# EAGLE design syringe board 2.1 (EAGLE 9.0.0)
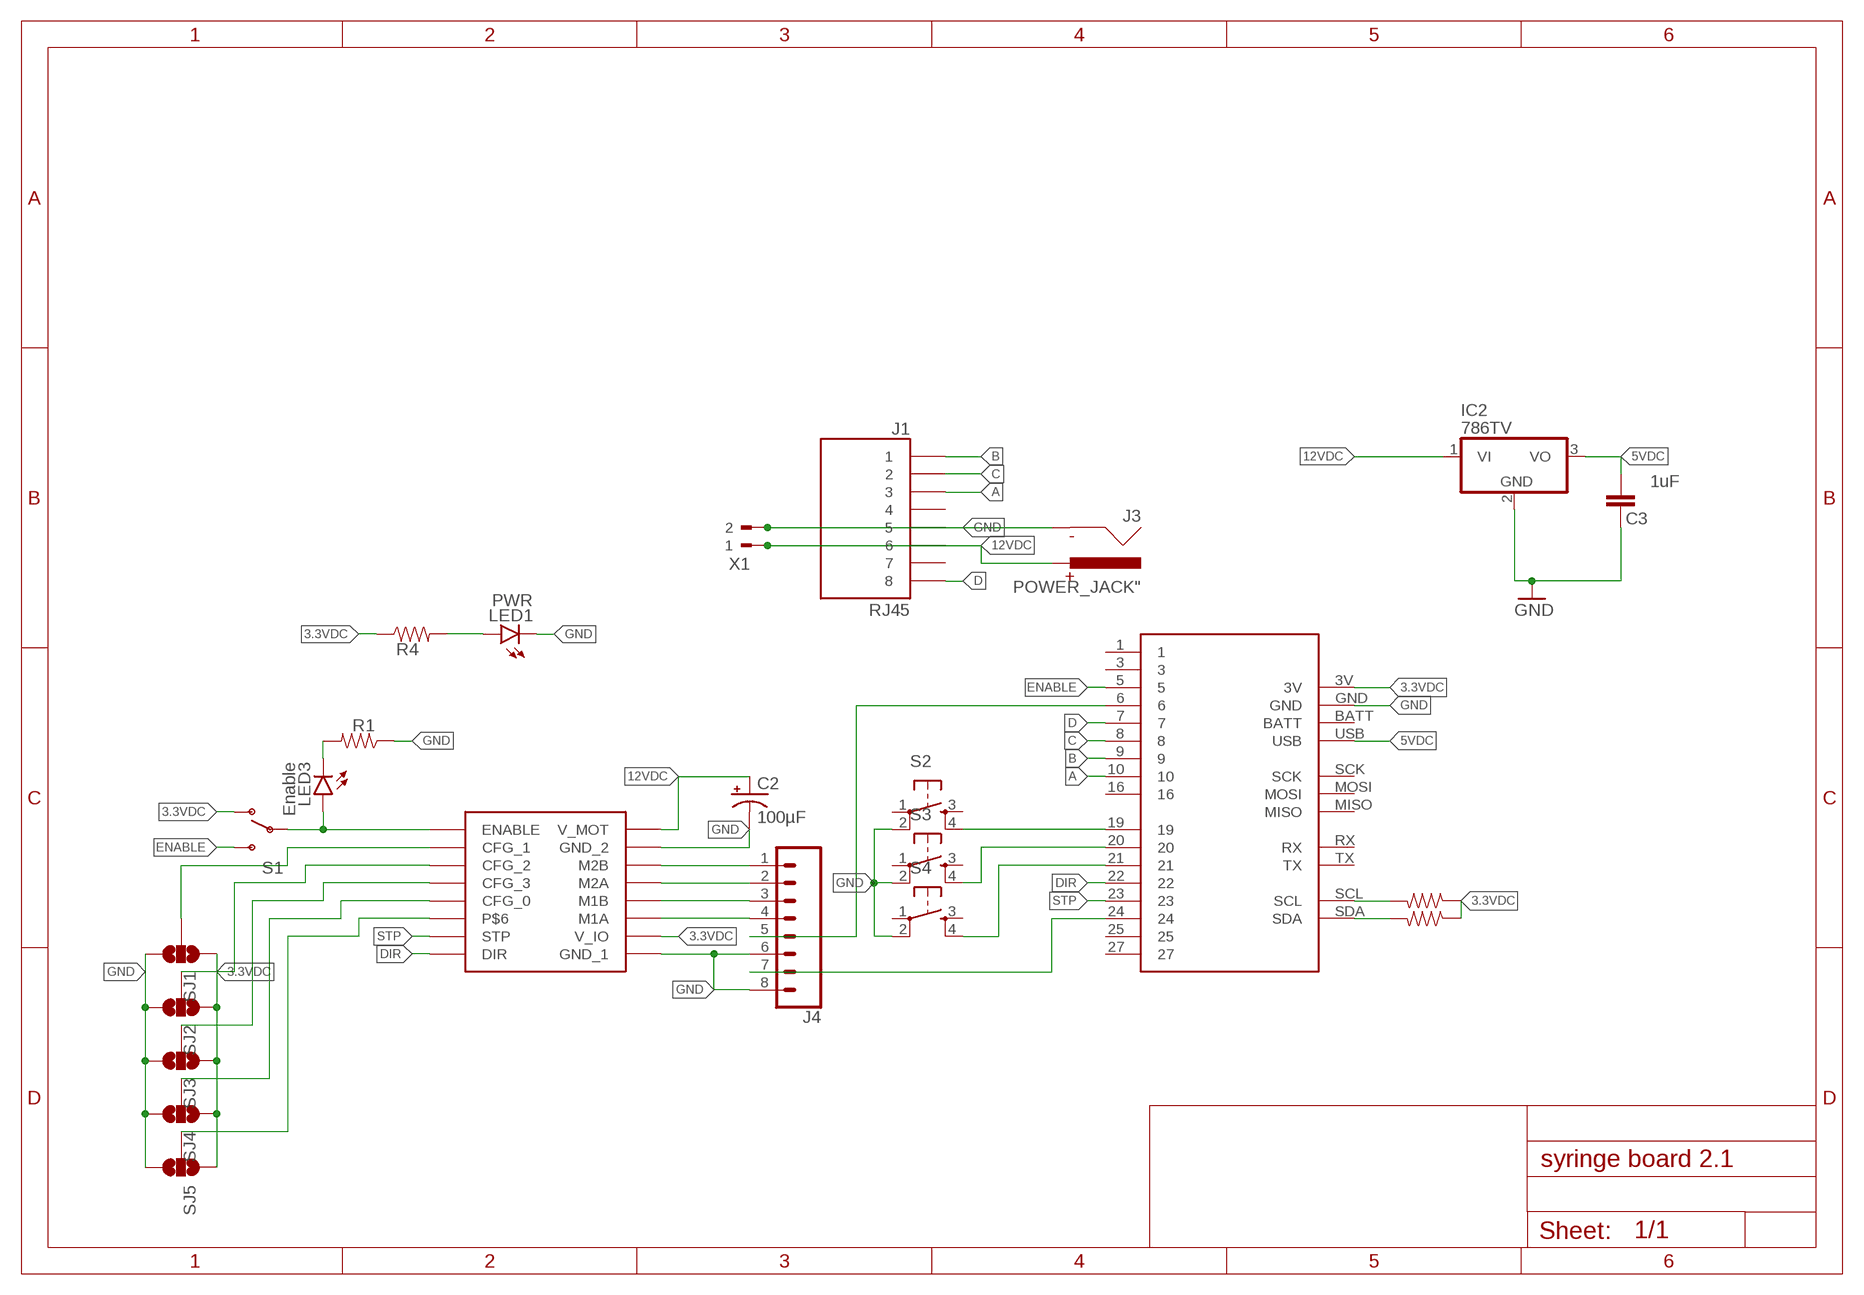
[diagram p0: schematic, sheet 1]

## Parts
C2  100µF  CPOL-USD  [PANASONIC_D]
C3  1uF  CAP0603-CAP  [0603-CAP]
IC2  786TV  [TO220V]
J1  RJ45  [RJ45-8]
J3  POWER_JACK"  [BARREL_CONN]
J4  CONN_08NO_SILK_FEMALE_PTH  [1X08_NO_SILK]
LED1  PWR  LED0603  [LED-0603]
LED3  Enable  LED0603  [LED-0603]
R1  RESISTOR0603  [0603]
R4  RESISTOR0603  [0603]
R17  RESISTOR0603  [0603]
R20  RESISTOR0603  [0603]
S1  SWITCH-SPDTVERTICAL_TOGGLE  [VERT_TOGGLE]
S2  TAC_SWITCHSMD  TAC_SWITCHPTH  [TACTILE-PTH]
S3  TAC_SWITCHSMD  TAC_SWITCHPTH  [TACTILE-PTH]
S4  TAC_SWITCHSMD  TAC_SWITCHPTH  [TACTILE-PTH]
SJ1  SOLDERJUMPER_2WAYS  [SJ_3]
SJ2  SOLDERJUMPER_2WAYS  [SJ_3]
SJ3  SOLDERJUMPER_2WAYS  [SJ_3]
SJ4  SOLDERJUMPER_2WAYS  [SJ_3]
SJ5  SOLDERJUMPER_2WAYS  [SJ_3]
U$1  SILENT_STEP_STICK  [SILENT_STEP_STICK]
U$2  FEATHERFEAT  [FEATHER]
X1  90-2  [90-2]

## Nets
3.3VDC: R4.1 R17.1 R20.1 S1.P$1(O) SJ1.1 SJ2.1 SJ3.1 SJ4.1 SJ5.1 U$1.V_IO U$2.3V
5VDC: C3.2 IC2.3(VO) U$2.USB
12VDC: C2.+ IC2.1(VI) J1.6 J3.PWR U$1.V_MOT X1.1
A: J1.3 U$2.10
B: J1.1 U$2.9
C: J1.2 U$2.8
CFG_0: SJ4.2 U$1.CFG_0
CFG_1: SJ1.2 U$1.CFG_1
CFG_2: SJ2.2 U$1.CFG_2
CFG_3: SJ3.2 U$1.CFG_3
D: J1.8 U$2.7
DIR: U$1.DIR U$2.22
ENABLE: S1.P$3(S) U$2.5
GND: C2.- C3.1 IC2.2(GND) J1.5 J3.GND J4.6 J4.8 LED1.C R1.1 S2.2 S3.2 S4.2 SJ1.3 SJ2.3 SJ3.3 SJ4.3 SJ5.3 U$1.G_1(GND_1) U$1.G_2(GND_2) U$2.GND X1.2
N$1: R17.2 U$2.SCL
N$2: J4.5 U$2.6
N$3: R20.2 U$2.SDA
N$4: J4.1 U$1.M2B
N$6: LED3.A S1.P$2(P) U$1.ENABLE
N$7: S2.4 U$2.19
N$8: LED1.A R4.2
N$9: J4.2 U$1.M2A
N$10: LED3.C R1.2
N$11: S3.4 U$2.20
N$12: S4.4 U$2.21
N$14: J4.3 U$1.M1B
N$15: J4.4 U$1.M1A
N$16: J4.7 U$2.24
N/C: SJ5.2 U$1.P$6
STP: U$1.STP U$2.23
Unconnected: J1.4 J1.7 S2.1 S2.3 S3.1 S3.3 S4.1 S4.3 U$2.1 U$2.3 U$2.16 U$2.25 U$2.27 U$2.BATT U$2.MISO U$2.MOSI U$2.RX U$2.SCK U$2.TX

## Library data of the parts
C2 = adafruit:CPOL-US: POLARIZED CAPACITOR, American symbol
C3 = SparkFun-Capacitors:CAP: Capacitor Standard 0603 ceramic capacitor, and 0.1" leaded capacitor.
IC2 = Andy-library:78*: Positive VOLTAGE REGULATOR Source: http://cache.national.com/ds/LM/LM78L05.pdf http://www.fairchildsemi.com/ds/LM/LM7805.pdf
J1 = Andy-library:RJ45
J3 = Andy-library:POWER_JACK: 5mm Barrel Power Connector CP-037A-ND <http://www.digikey.com/product-detail/en/cui-inc/PJ-037A/CP-037A-ND/1644545>; DIGIKEY_PN: CP-037A-ND; MANUFACTURER: CUI Inc; MFG_PN: PJ-037A
J4 = SparkFun-Connectors:CONN_08: Multi connection point. Often used as Generic Header-pin footprint for 0.1 inch spaced/style header connections On any of the 0.1 inch spaced packages, you can populate with these: Break Away Headers - Straight <https://www.sparkfun.com/products/116> (PRT-00116) Break Away Male Headers - Right Angle <https://www.sparkfun.com/products/553> (PRT-00553) Female Headers <https://www.sparkfun.com/products/115> (PRT-00115) Break Away Headers - Machine Pin <https://www.sparkfun.com/products/117> (PRT-00117) Break Away Female Headers - Swiss Machine Pin <https://www.sparkfun.com/products/743> (PRT-00743) Arduino Stackable Header - 8 Pin <https://www.sparkfun.com/products/9279> (PRT-09279) For SCREWTERMINALS and SPRING TERMINALS visit here: Screw Terimnals on SparkFun.com <https://www.sparkfun.com/search/results?term=Screw+Terminals> (5mm/3.5mm/2.54mm spacing) This device is also useful as a general connection point to wire up your design to another part of your project. Our various solder wires solder well into these plated through hole pads. Hook-Up Wire - Assortment (Stranded, 22 AWG) <https://www.sparkfun.com/products/11375> (PRT-11375) Hook-Up Wire - Assortment (Solid Core, 22 AWG) <https://www.sparkfun.com/products/11367> (PRT-11367) View the entire wire category on our website here <https://www.sparkfun.com/categories/141> Special notes: Molex polarized connector foot print use with SKU : PRT-08231 with associated crimp pins and housings. 1MM SMD Version SKU: PRT-10208 NOTES ON THE VARIANTS LOCK and LOCK_LONGPADS... This footprint was designed to help hold the alignment of a through-hole component (i.e. 6-pin header) while soldering it into place. You may notice that each hole has been shifted either up or down by 0.005 of an inch from it's more standard position (which is a perfectly straight line). This slight alteration caused the pins (the squares in the middle) to touch the edges of the holes. Because they are alternating, it causes a "brace" to hold the component in place. 0.005 has proven to be the perfect amount of "off-center" position when using our standard breakaway headers. Although looks a little odd when you look at the bare footprint, once you have a header in there, the alteration is very hard to notice. Also,if you push a header all the way into place, it is covered up entirely on the bottom side.; PROD_ID: CONN-08438
LED1 LED3 = Andy-library:LED: LEDs Standard schematic elements and footprints for 5mm, 3mm, 1206, and 0603 sized LEDs. 5mm - Spark Fun Electronics SKU : COM-00529 (and others)
R1 R4 R17 R20 = SparkFun-Resistors:RESISTOR: Generic Resistor Package
S1 = Andy-library:SWITCH-SPDT: SPDT Switch slide switch: AYZ0102AGRLC <http://www.digikey.com/product-detail/en/c-k/AYZ0102AGRLC/401-2012-1-ND/1640121> vertical toggle: ATE1D-2M3-10-Z <http://www.digikey.com/product-search/en?keywords=ATE1D-2M3-10-Z> horizontal toggle: ATE1D-5M3-10-Z <http://www.digikey.com/product-search/en?keywords=ATE1D-5M3-10-Z>
S2-S4 = Andy-library:TAC_SWITCH: Momentary Switch Button commonly used for reset or general input. Spark Fun Electronics SKU : COM-00097 SMT- SWCH-08247
SJ1-SJ5 = SparkFun-Retired:SOLDERJUMPER_2WAY: Solder Jumper 2 way solder jumper
U$1 = Andy-library:SILENT_STEP_STICK
U$2 = Andy-library:FEATHER
X1 = con-weidmueller-sl35:90-2: WEIDMUELLER CLAMP CONNECTOR; OC_FARNELL: unknown; OC_NEWARK: unknown

## Board
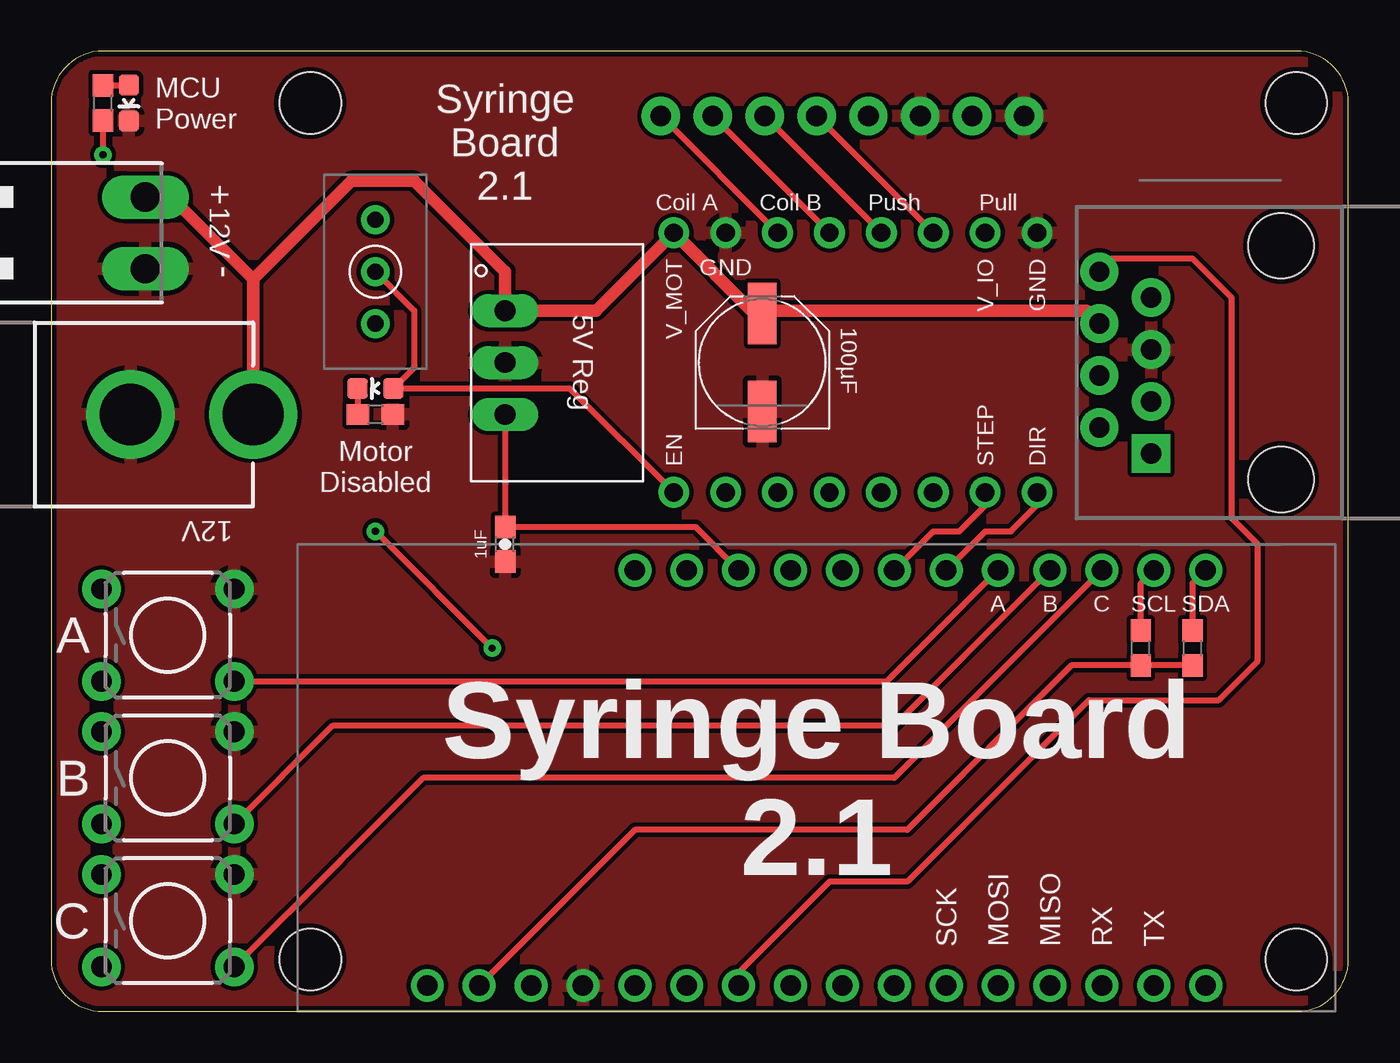
[diagram p1: board, top side]
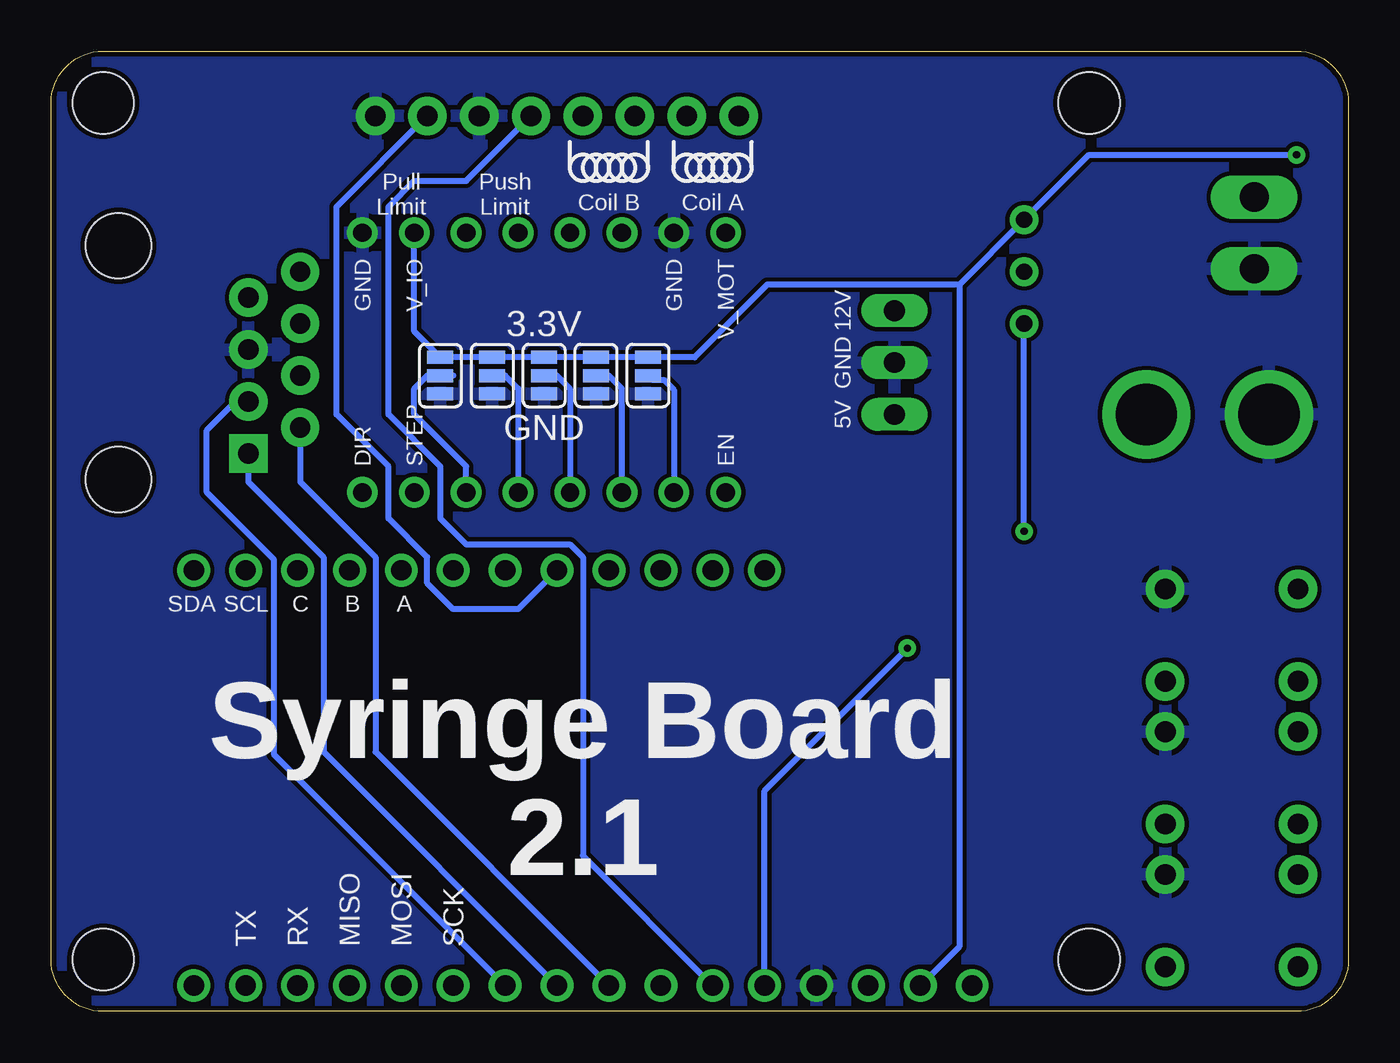
[diagram p2: board, bottom side, seen from below]

Size 63.5 x 46.99 mm. Coordinates in mm from the lower left corner, seen from the top.
Outline: 0,44.45 0,2.54 arc90 2.54,0 60.96,0 arc90 63.5,2.54 63.5,44.45 arc90 60.96,46.99 2.54,46.99 arc90 0,44.45
Copper layers (1*16): Top 0.035mm / dielectric 1.5mm / Bottom 0.035mm
Design rules "GoldPhoenix_8and8 *": minimum track width 7mil, minimum drill 15mil, track to track 8mil, track to pad 8mil, pad to pad 8mil, via to via 8mil, smd to smd 8mil, copper to edge 10mil, drill to drill 8mil, minimum pad ring 12mil, minimum via ring 10mil, stop-mask expansion 4mil, vias tented up to drill 25mil, thermal gap 10mil
Holes 3 mm at 12.68,2.54 60.94,44.45 60.94,2.54 12.68,44.45

### Footprints (pad centres in the part's own frame; a part is rotated, then mirrored left to right if it is on the bottom)
PANASONIC_D = smd 3 x 1.4: + 2.4,0; - -2.4,0
0603-CAP = smd 1.1 x 1: 1 -0.85,0; 2 0.85,0
TO220V = drill 1.016 long: 1 -2.54,-2.54; 2 0,-2.54; 3 2.54,-2.54
RJ45-8 = drill 1 pad 1.88 square: 1 -4.445,6.35 | drill 1 pad 1.88: 2 -3.175,8.89; 3 -1.905,6.35; 4 -0.635,8.89; 5 0.635,6.35; 6 1.905,8.89; 7 3.175,6.35; 8 4.445,8.89 | hole 3.2: -5.715,0; 5.715,0
BARREL_CONN = drill 2.997 pad 4.318: GND 0,7.7; PWR 0,13.7
1X08_NO_SILK = drill 1.016 pad 1.88: 1 0,0; 2 2.54,0; 3 5.08,0; 4 7.62,0; 5 10.16,0; 6 12.7,0; 7 15.24,0; 8 17.78,0
LED-0603 = smd 1 x 1: A 0,-0.877; C 0,0.877
0603 = smd 1.1 x 1: 1 -0.85,0; 2 0.85,0
VERT_TOGGLE = drill 0.8: P$1 0,2.54; P$2 0,0; P$3 0,-2.54
TACTILE-PTH = drill 1.016 pad 1.88: 1 -3.251,2.261; 2 3.251,2.261; 3 -3.251,-2.261; 4 3.251,-2.261
SJ_3 = smd 0.635 x 1.27: 1 -0.889,0; 2 0,0; 3 0.889,0
SILENT_STEP_STICK = drill 0.9: CFG_0 -6.35,-1.27; CFG_1 -6.35,6.35; CFG_2 -6.35,3.81; CFG_3 -6.35,1.27; DIR -6.35,-8.89; ENABLE -6.35,8.89; G_1 6.35,-8.89; G_2 6.35,6.35; M1A 6.35,-3.81; M1B 6.35,-1.27; M2A 6.35,1.27; M2B 6.35,3.81; P$6 -6.35,-3.81; STP -6.35,-6.35; V_IO 6.35,-6.35; V_MOT 6.35,8.89
FEATHER = drill 1: 1 -19.05,-10.16; 3 -13.97,-10.16; 3V -16.51,-10.16; 5 -8.89,-10.16; 6 -6.35,-10.16; 7 -3.81,-10.16; 8 -1.27,-10.16; 9 1.27,-10.16; 10 3.81,-10.16; 16 19.05,-10.16; 19 13.97,10.16; 20 11.43,10.16; 21 8.89,10.16; 22 6.35,10.16; 23 3.81,10.16; 24 1.27,10.16; 25 -1.27,10.16; 27 -6.35,10.16; BATT -8.89,10.16; GND -11.43,-10.16; MISO 11.43,-10.16; MOSI 8.89,-10.16; RX 13.97,-10.16; SCK 6.35,-10.16; SCL 16.51,10.16; SDA 19.05,10.16; TX 16.51,-10.16; USB -3.81,10.16
90-2 = drill 1.422 long: 1 -1.75,5.25; 2 1.75,5.25

### Placement (x,y rotation side)
C2  34.81,31.75 90 top
C3  22.23,22.86 90 top
IC2  24.77,31.75 270 top
J1  60.2,31.75 90 top
J3  -3.81,29.21 270 top
J4  29.84,43.81 0 top
LED1  3.81,44.45 180 top
LED3  15.88,30.48 90 top
R1  15.88,29.21 180 top
R4  2.54,44.45 90 top
R17  53.34,17.78 90 top
R20  55.88,17.78 90 top
S1  15.88,36.2 0 top
S2  5.71,4.45 0 top
S3  5.71,11.43 0 top
S4  5.71,18.41 0 top
SJ1  34.29,31.11 270 bottom
SJ2  36.83,31.11 270 bottom
SJ3  39.37,31.11 270 bottom
SJ4  41.91,31.11 270 bottom
SJ5  44.45,31.11 270 bottom
U$1  39.37,31.75 90 top
U$2  37.47,11.43 0 top
X1  -0.64,38.1 270 top

### Tracks (layer width: path | path; a pad name or v marks a point on that pad's centre or on a via)
3.3VDC  (via drill 0.35)
  Top 0.305: R20.1 R17.1 49.95,16.93 41.91,8.89 28.57,8.89 U$2.3V | 2.54,43.18 R4.1 v2.54,41.91
  Bottom 0.305: U$1.V_IO 45.72,33.27 SJ5.1 SJ4.1 SJ3.1 SJ2.1 SJ1.1 32,32 28.45,35.56 19.05,35.56 | 19.05,35.56 S1.P$1 12.7,41.91 v2.54,41.91 | U$2.3V 19.05,3.17 19.05,35.56
5VDC
  Top 0.305: 22.23,28.59 IC2.3 C3.2 31.54,23.71 U$2.USB
12VDC
  Top 0.61: J3.PWR 9.89,35.83 | X1.1 5.87,39.85 9.89,35.83 | 9.89,35.83 14.7,40.64 17.78,40.64 22.23,36.2 IC2.1 26.67,34.29 U$1.V_MOT 34.43,34.15 C2.+ 34.95,34.29 50.67,34.29 J1.6
A
  Bottom 0.305: U$2.10 52.59,12.59 52.59,22.11 55.88,25.4 55.88,28.43 53.85,30.46 J1.3
B
  Bottom 0.305: J1.1 53.85,25.91 50.16,22.23 50.16,12.7 U$2.9
C
  Bottom 0.305: J1.2 51.31,25.91 47.62,22.23 47.62,12.7 U$2.8
CFG_0
  Bottom 0.305: SJ4.2 41.27,31.11 40.64,30.48 U$1.CFG_0
CFG_1
  Bottom 0.305: SJ1.2 34.07,30.9 33.51,30.9 33.02,30.41 U$1.CFG_1
CFG_2
  Bottom 0.305: U$1.CFG_2 35.56,30.48 36.2,31.11 SJ2.2
CFG_3
  Bottom 0.305: SJ3.2 38.73,31.11 38.1,30.48 U$1.CFG_3
D
  Top 0.305: U$2.7 33.66,1.91 38.1,6.35 41.91,6.35 50.8,15.24 57.15,15.24 59.05,17.14 59.05,22.86 57.78,24.13 57.78,34.92 55.88,36.83 51.94,36.83 J1.8
DIR
  Top 0.305: U$2.22 45.4,23.18 45.72,23.5 46.99,23.5 48.26,24.77 U$1.DIR
ENABLE  (via drill 0.35)
  Top 0.305: v21.59,17.78 v15.88,23.5
  Bottom 0.305: U$2.5 28.57,10.79 v21.59,17.78 | v15.88,23.5 S1.P$3
GND
  pour Bottom: -1.29,49.78 69.96,49.66 69.83,-3.81 -1.29,-3.81
  pour Top: -2.57,48.45 67.41,48.32 67.29,-5.08 -2.56,-5.08
N$1
  Top 0.305: R17.2 53.34,20.95 U$2.SCL
N$2
  Bottom 0.305: J4.5 43.18,40.64 45.72,40.64 46.99,39.37 46.99,29.21 44.45,26.67 44.45,24.13 43.18,22.86 38.1,22.86 37.47,22.23 37.47,7.62 U$2.6
N$3
  Top 0.305: U$2.SDA 55.88,20.95 R20.2
N$4
  Top 0.305: U$1.M2B J4.1
N$6
  Top 0.305: S1.P$2 17.78,34.29 17.78,31.51 LED3.A 17.78,30.48 18.41,30.48 25.4,30.48 U$1.ENABLE
N$7
  Top 0.305: S2.4 14.19,7.4 14.4,7.62 18.21,11.43 41.27,11.43 U$2.19
N$8
  Top 0.305: R4.2 2.57,45.33 LED1.A
N$9
  Top 0.305: U$1.M2A J4.2
N$10
  Top 0.305: R1.2 15.03,30.45 LED3.C
N$11
  Top 0.305: U$2.20 41.27,13.97 13.77,13.97 S3.4
N$12
  Top 0.305: S4.4 40.92,16.15 U$2.21
N$14
  Top 0.305: J4.3 U$1.M1B
N$15
  Top 0.305: J4.4 U$1.M1A
N$16
  Bottom 0.305: U$2.24 40.64,19.68 43.81,19.68 45.09,20.95 45.09,22.23 46.99,24.13 46.99,26.67 49.53,29.21 49.53,39.37 J4.7
N/C
  Bottom 0.305: 43.81,31.11 SJ5.2 45.09,31.11 45.72,30.48 45.72,29.21 43.18,26.67 U$1.P$6
STP
  Top 0.305: U$2.23 43.18,23.5 44.45,23.5 45.72,24.77 U$1.STP

### Text on the board
tNames: MCU / Power | Syringe / Board / 2.1 | + | Coil A | Coil B | Push | Pull | 12V | V_MOT | GND | V_IO | GND | - | 5V Reg | Motor / Disabled | EN | STEP | DIR | 12V | A | B | C | SCL | SDA | A | B | Syringe Board / 2.1 | C | SCK | MOSI | MISO | RX | TX
bNames: Coil A | Coil B | Push / Limit | Pull / Limit | V_MOT | GND | V_IO | GND | 12V | 3.3V | GND | 5V | GND | EN | STEP | DIR | A | B | C | SCL | SDA | Syringe Board / 2.1 | SCK | MOSI | MISO | RX | TX